# EAGLE design 3PCurrentTX (EAGLE 6.2)
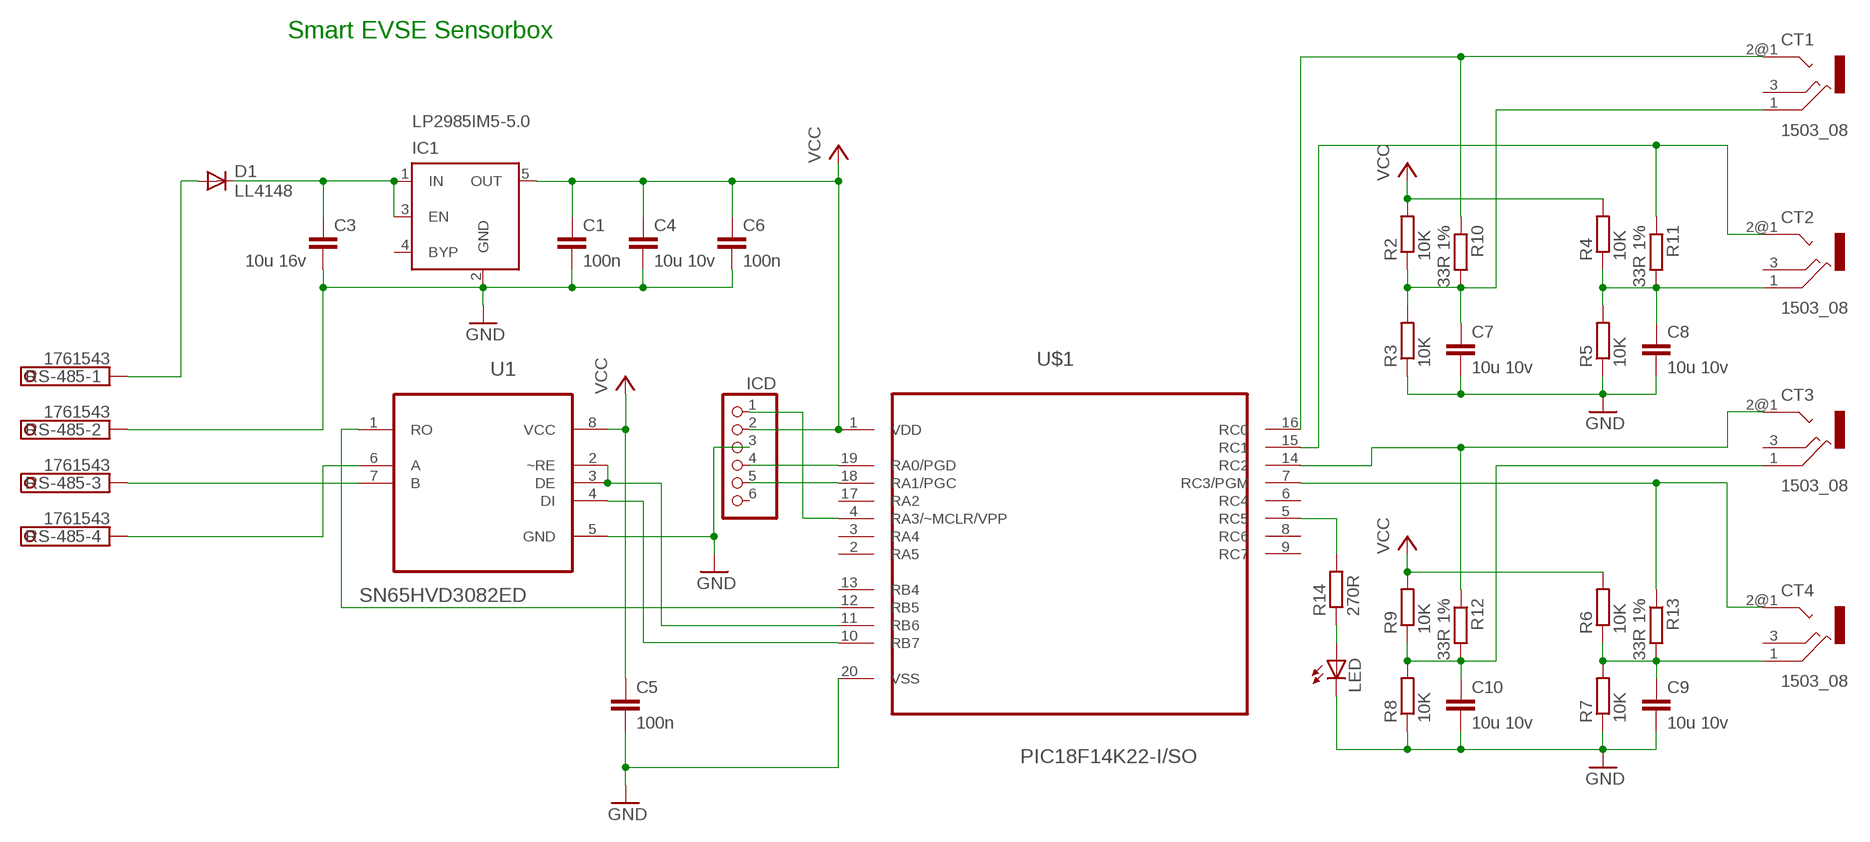
[diagram p0: schematic, sheet 1]

## Parts
C1  100n  C-EUC0805K  [C0805K]
C3  10u 16v  C-EUC1206K  [C1206K]
C4  10u 10v  C-EUC0805K  [C0805K]
C5  100n  C-EUC0805K  [C0805K]
C6  100n  C-EUC0805K  [C0805K]
C7  10u 10v  C-EUC0805K  [C0805K]
C8  10u 10v  C-EUC0805K  [C0805K]
C9  10u 10v  C-EUC0805K  [C0805K]
C10  10u 10v  C-EUC0805K  [C0805K]
CT1  1503_08  [1503_08]
CT2  1503_08  [1503_08]
CT3  1503_08  [1503_08]
CT4  1503_08  [1503_08]
D1  LL4148  DIODE-SOD123  [SOD123]
IC1  LP2985IM5-5.0  MIC5219XX  [SOT23-5]
ICD  PINHD-1X6  [1X06]
LED  LEDSML0805  [SML0805]
R2  10K  R-EU_R0805  [R0805]
R3  10K  R-EU_R0805  [R0805]
R4  10K  R-EU_R0805  [R0805]
R5  10K  R-EU_R0805  [R0805]
R6  10K  R-EU_R0805  [R0805]
R7  10K  R-EU_R0805  [R0805]
R8  10K  R-EU_R0805  [R0805]
R9  10K  R-EU_R0805  [R0805]
R10  33R 1%  R-EU_R0805  [R0805]
R11  33R 1%  R-EU_R0805  [R0805]
R12  33R 1%  R-EU_R0805  [R0805]
R13  33R 1%  R-EU_R0805  [R0805]
R14  270R  R-EU_R0805  [R0805]
RS-485  1761543  1751264  [1751264]
U1  SN65HVD3082ED  MAX487ECSA+  [SOIC127P600X175-8N]
U$1  PIC18F14K22-I/SO  [SOIC127P1030X265-20N]

## Nets
GND: C1.2 C3.2 C4.2 C5.2 C6.2 C7.2 C8.2 C9.2 C10.2 IC1.2(GND) ICD.3 LED.C R3.1 R5.1 R7.1 R8.1 RS-485.2 U1.5(GND) U$1.20(VSS)
N$2: D1.A RS-485.1
N$3: R14.2 U$1.5(RC5)
N$4: U1.1(RO) U$1.12(RB5)
N$5: U1.4(DI) U$1.10(RB7)
N$6: U1.2(~RE) U1.3(DE) U$1.11(RB6)
N$7: CT1.2@1 R10.1 U$1.16(RC0)
N$8: LED.A R14.1
N$9: CT3.2@1 R12.1 U$1.14(RC2)
N$10: CT4.2@1 R13.1 U$1.7(RC3/PGM)
N$11: CT2.2@1 R11.1 U$1.15(RC1)
N$12: RS-485.3 U1.7(B)
N$13: RS-485.4 U1.6(A)
N$14: C7.1 CT1.1 R2.1 R3.2 R10.2
N$15: C3.1 D1.C IC1.1(IN) IC1.3(EN)
N$16: ICD.5 U$1.18(RA1/PGC)
N$18: C8.1 CT2.1 R4.1 R5.2 R11.2
N$19: ICD.1 U$1.4(RA3/~MCLR/VPP)
N$20: C10.1 CT3.1 R8.2 R9.1 R12.2
N$21: C9.1 CT4.1 R6.1 R7.2 R13.2
N$22: ICD.4 U$1.19(RA0/PGD)
VCC: C1.1 C4.1 C5.1 C6.1 IC1.5(OUT) ICD.2 R2.2 R4.2 R6.2 R9.2 U1.8(VCC) U$1.1(VDD)
Unconnected: CT1.2@2 CT1.3 CT2.2@2 CT2.3 CT3.2@2 CT3.3 CT4.2@2 CT4.3 IC1.4(BYP) ICD.6 U$1.2(RA5) U$1.3(RA4) U$1.6(RC4) U$1.8(RC6) U$1.9(RC7) U$1.13(RB4) U$1.17(RA2)

## Notes on the sheet
- Smart EVSE Sensorbox

## Library data of the parts
C1 C3-C10 = resistor:C-EU: CAPACITOR, European symbol
CT1-CT4 = con-lumberg:1503_?: Jack connectors according to JISC 6560, 3.5 mm Klinkensteckverbinder nach JISC 6560, 3,5 mm Source: http://www.lumberg.com/Produkte/PDFs/1503_08.pdf; OC_FARNELL: unknown; OC_NEWARK: unknown
D1 = diode:DIODE-: DIODE
IC1 = v-reg-micrel:MIC5219XX: VOLTAGE REGULATOR; OC_FARNELL: unknown; OC_NEWARK: unknown
ICD = pinhead:PINHD-1X6: PIN HEADER
LED = led:LED: LED OSRAM: - CHIPLED LG R971, LG N971, LY N971, LG Q971, LY Q971, LO R971, LY R971 LH N974, LH R974 LS Q976, LO Q976, LY Q976 LO Q996 - Hyper CHIPLED LW Q18S LB Q993, LB Q99A, LB R99A - SideLED LS A670, LO A670, LY A670, LG A670, LP A670 LB A673, LV A673, LT A673, LW A673 LH A674 LY A675 LS A676, LA A676, LO A676, LY A676, LW A676 LS A679, LY A679, LG A679 - Hyper Micro SIDELED® LS Y876, LA Y876, LO Y876, LY Y876 LT Y87S - SmartLED LW L88C, LW L88S LB L89C, LB L89S, LG L890 LS L89K, LO L89K, LY L89K LS L896, LA L896, LO L896, LY L896 - TOPLED LS T670, LO T670, LY T670, LG T670, LP T670 LSG T670, LSP T670, LSY T670, LOP T670, LYG T670 LG T671, LOG T671, LSG T671 LB T673, LV T673, LT T673, LW T673 LH T674 LS T676, LA T676, LO T676, LY T676, LB T676, LH T676, LSB T676, LW T676 LB T67C, LV T67C, LT T67C, LS T67K, LO T67K, LY T67K, LW E67C LS E67B, LA E67B, LO E67B, LY E67B, LB E67C, LV E67C, LT E67C LW T67C LS T679, LY T679, LG T679 LS T770, LO T770, LY T770, LG T770, LP T770 LB T773, LV T773, LT T773, LW T773 LH T774 LS E675, LA E675, LY E675, LS T675 LS T776, LA T776, LO T776, LY T776, LB T776 LHGB T686 LT T68C, LB T68C - Hyper Mini TOPLED® LB M676 - Mini TOPLED Santana® LG M470 LS M47K, LO M47K, LY M47K Source: http://www.osram.convergy.de LUXEON: - LUMILED® LXK2-PW12-R00, LXK2-PW12-S00, LXK2-PW14-U00, LXK2-PW14-V00 LXK2-PM12-R00, LXK2-PM12-S00, LXK2-PM14-U00 LXK2-PE12-Q00, LXK2-PE12-R00, LXK2-PE12-S00, LXK2-PE14-T00, LXK2-PE14-U00 LXK2-PB12-K00, LXK2-PB12-L00, LXK2-PB12-M00, LXK2-PB14-N00, LXK2-PB14-P00, LXK2-PB14-Q00 LXK2-PR12-L00, LXK2-PR12-M00, LXK2-PR14-Q00, LXK2-PR14-R00 LXK2-PD12-Q00, LXK2-PD12-R00, LXK2-PD12-S00 LXK2-PH12-R00, LXK2-PH12-S00 LXK2-PL12-P00, LXK2-PL12-Q00, LXK2-PL12-R00 Source: www.luxeon.com KINGBRIGHT: KA-3528ASYC Source: www.kingbright.com
R2-R14 = rcl:R-EU_: RESISTOR, European symbol
RS-485 = con-phoenix-350:1751264: MKDS 1/ 4-3,5 Printklemme Nennstrom: 10 A Bemessungsspannung: 160 V Raster: 3,5 mm Polzahl: 4 Montageart: Löten Anschlussart: Schraubanschluss Anschlussrichtung vom Leiter zur Platine: 0° Source: http://eshop.phoenixcontact.com .. 1751264.pdf; MPN: 1751264; OC_FARNELL: unknown; OC_NEWARK: 10R0934
U1 = max487:MAX487ECSA+: Low-Power, Slew-Rate-Limited RS-485/RS-422 Transceivers; MPN: MAX487ECSA+; OC_FARNELL: 9724532; OC_NEWARK: 68K4803; PACKAGE: SOIC-8; SUPPLIER: Maxim
U$1 = pic_18f14k22:PIC18F14K22-I/SO: Flash Microcontrollers; MPN: PIC18F14k22-I/SO; OC_FARNELL: 1778463; OC_NEWARK: 07P9676; PACKAGE: SOIC-20; SUPPLIER: Microchip

## Board
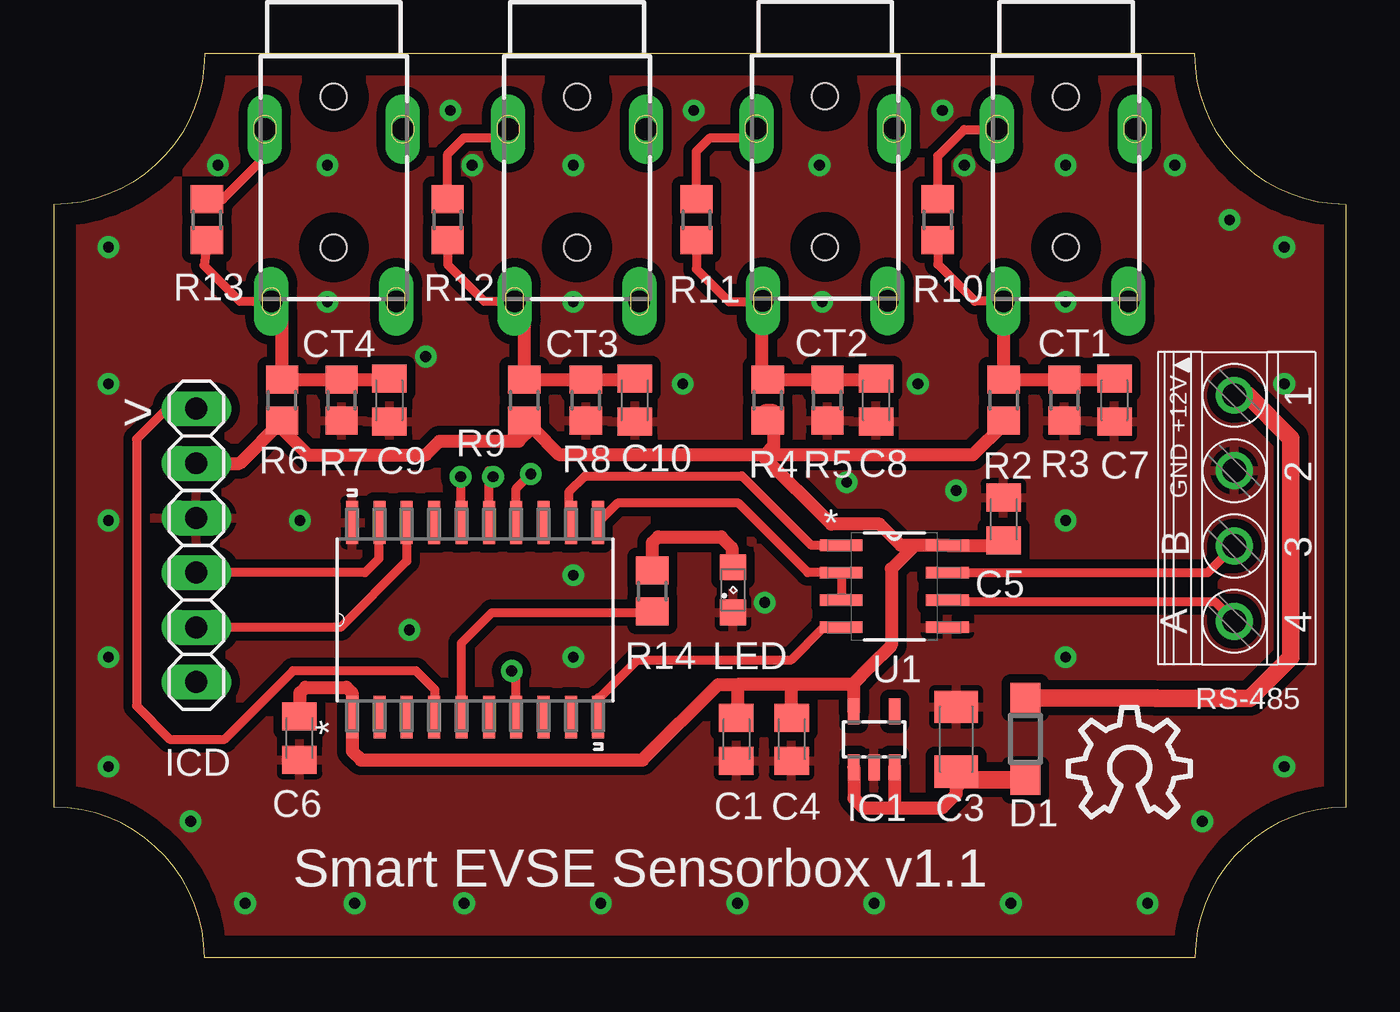
[diagram p1: board, top side]
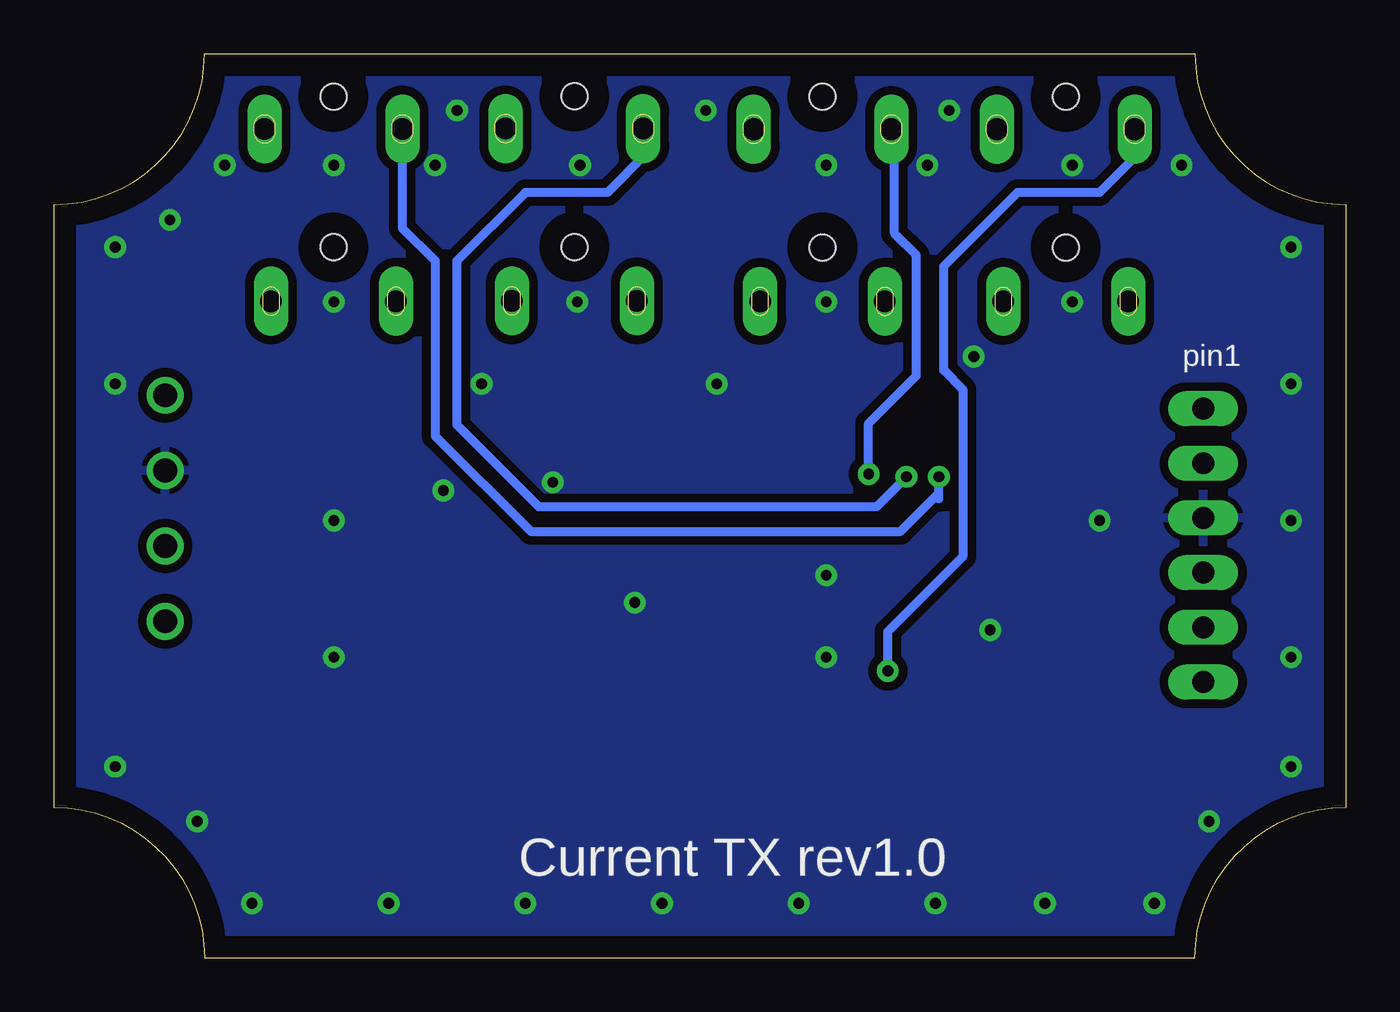
[diagram p2: board, bottom side, seen from below]

Size 60 x 42 mm. Coordinates in mm from the lower left corner, seen from the top.
Outline: 60,7.54 60,35 arc-90 53,42 7,42 arc-90 0,35 0,7 arc-90 7,0 53,0 arc-90 60,7 60,7.5
Copper layers (1*16): Top 0.035mm / dielectric 1.5mm / Bottom 0.035mm
Design rules: minimum track width 10mil, minimum drill 0.5mm, track to track 8mil, track to pad 8mil, pad to pad 8mil, via to via 8mil, smd to smd 8mil, copper to edge 40mil, drill to drill 8mil, minimum pad ring 12mil, minimum via ring 10mil, stop-mask expansion 4mil, vias tented up to drill 20mil, thermal gap 10mil

### Footprints (pad centres in the part's own frame; a part is rotated, then mirrored left to right if it is on the bottom)
C0805K = smd 1.3 x 1.6: 1 -1,0; 2 1,0
C1206K = smd 1.5 x 2: 1 -1.5,0; 2 1.5,0
1503_08 = drill 1 pad 1.2 long: 1 -2.9,-8; 2@1 -3.2,0; 2@2 3.2,0; 3 2.9,-8 | hole 1.2: 0,1.5; 0,-5.5
SOD123 = smd 1.4 x 1.4: A 1.9,0; C -1.9,0
SOT23-5 = smd 0.55 x 1.2: 1 -0.95,-1.3; 2 0,-1.3; 3 0.95,-1.3; 4 0.95,1.3; 5 -0.95,1.3
1X06 = drill 1.016 long: 1 -6.35,0; 2 -3.81,0; 3 -1.27,0; 4 1.27,0; 5 3.81,0; 6 6.35,0
SML0805 = smd 1.2 x 1.2: A 1.05,0; C -1.05,0
R0805 = smd 1.3 x 1.5: 1 -0.95,0; 2 0.95,0
1751264 = drill 1.1 pad 1.7: 1 -5.25,-0.1; 2 -1.75,-0.1; 3 1.75,-0.1; 4 5.25,-0.1
SOIC127P600X175-8N = smd 1.981 x 0.533: 1 -2.464,1.905; 2 -2.464,0.635; 3 -2.464,-0.635; 4 -2.464,-1.905; 5 2.464,-1.905; 6 2.464,-0.635; 7 2.464,0.635; 8 2.464,1.905
SOIC127P1030X265-20N = smd 1.981 x 0.559: 1 -4.521,5.715; 2 -4.521,4.445; 3 -4.521,3.175; 4 -4.521,1.905; 5 -4.521,0.635; 6 -4.521,-0.635; 7 -4.521,-1.905; 8 -4.521,-3.175; 9 -4.521,-4.445; 10 -4.521,-5.715; 11 4.521,-5.715; 12 4.521,-4.445; 13 4.521,-3.175; 14 4.521,-1.905; 15 4.521,-0.635; 16 4.521,0.635; 17 4.521,1.905; 18 4.521,3.175; 19 4.521,4.445; 20 4.521,5.715

### Placement (x,y rotation side)
C1  31.7,10.16 270 top
C3  41.91,10.16 90 top
C4  34.27,10.16 270 top
C5  44.11,20.38 90 top
C6  11.41,10.21 270 top
C7  49.26,25.91 270 top
C8  38.19,25.91 270 top
C9  15.59,25.91 270 top
C10  26.98,25.91 270 top
CT1  47.01,38.51 0 top
CT2  35.83,38.53 0 top
CT3  24.3,38.5 0 top
CT4  13,38.5 0 top
D1  45.12,10.18 90 top
IC1  38.1,10.16 0 top
ICD  6.62,19.17 270 top
LED  31.54,17.11 90 top
R2  44.12,25.91 270 top
R3  46.94,25.91 90 top
R4  33.16,25.91 270 top
R5  35.93,25.91 90 top
R6  10.6,25.91 270 top
R7  13.37,25.91 90 top
R8  24.71,25.91 90 top
R9  21.86,25.91 270 top
R10  41.06,34.29 270 top
R11  29.85,34.29 270 top
R12  18.29,34.29 270 top
R13  7.11,34.29 270 top
R14  27.8,17.04 270 top
RS-485  54.93,20.89 270 top
U1  39.04,17.26 0 top
U$1  19.57,15.71 90 top
U$2  [OSHW_10X200_NOTEXT]  47.12,6.57 0 top

### Tracks (layer width: path | path; a pad name or v marks a point on that pad's centre or on a via)
GND  (via drill 0.5)
  other vias: 13.97,2.54 24.13,13.97 24.13,17.78 16.51,15.24 12.7,30.48 29.21,26.67 40.13,26.67 2.54,33.02 2.54,26.67 2.54,20.32 2.54,13.97 2.54,8.89 6.35,6.35 8.89,2.54 7.62,36.83 12.7,36.83 18.41,39.37 24.13,36.83 29.72,39.37 35.56,36.83 41.27,39.37 46.99,36.83 52.07,36.83 54.61,34.29 57.15,33.02 57.15,26.67 57.15,8.89 53.34,6.35 50.8,2.54 44.45,2.54 38.1,2.54 31.75,2.54 25.4,2.54 19.05,2.54 33.02,16.51 46.99,20.32 46.99,13.97 17.27,27.94 36.83,22.1 41.91,21.72 35.69,30.48 46.99,30.48 24.13,30.48 19.43,36.83 42.29,36.83 11.43,20.32
  pour Top (isolate 0.406): 0,41.91 59.69,41.91 59.69,0 0,0
  pour Bottom (isolate 0.406): 0,41.91 59.69,41.91 59.69,0 0,0
N$2
  Top 0.406: 55.45,26.14 RS-485.1
  Top 0.813: 55.45,26.14 57.46,24.13 57.46,13.97 55.55,12.06 51.2,12.06 51.2,12.08 D1.A
N$3
  Top 0.406: U$1.5 18.93,14.62 20.36,16.05 27.76,16.05 R14.2
N$4
  Top 0.406: U$1.12 23.92,20.33 23.92,21.64 24.68,22.4 31.96,22.4 35.19,19.17 U1.1
N$5
  Top 0.254: 25.12,11.35 U$1.10
  Top 0.406: 25.19,11.29 U$1.10 25.29,12.09 25.34,12.09 27.1,13.85 34.25,13.85 35.7,15.3 36.52,15.3 U1.4
N$6
  Top 0.406: U1.3 U1.2 35.02,17.9 31.79,21.13 26.18,21.13 U$1.11
N$7  (via drill 0.5)
  Top 0.406: v18.89,22.35 18.89,20.27 U$1.16 | R10.1 41.06,37.25 42.29,38.48 43.78,38.48 CT1.2@1
  Bottom 0.406: CT1.2@1 43.81,33.91 42.29,32.38 42.29,24.26 37.85,19.81 20.67,19.81 18.89,21.59 | 18.89,21.34 18.89,21.59 | 18.89,21.59 v18.89,22.35
  Bottom 0.61: v18.89,22.35
N$8
  Top 0.61: R14.1 27.8,19.29 28.07,19.56 30.99,19.56 31.5,19.05 31.5,18.2 LED.A
N$9  (via drill 0.5)
  Top 0.406: U$1.14 21.48,21.8 v22.15,22.48 | R12.1 18.29,37.34 19.05,38.1 20.7,38.1 CT3.2@1
  Bottom 0.406: 21.1,37.32 CT3.2@1 20.95,38.35 20.95,33.66 19.94,32.64 19.94,27.05 22.15,24.84 v22.15,22.48
  Bottom 0.61: 20.89,38.29 CT3.2@1
N$10  (via drill 0.5)
  Top 0.406: U$1.7 21.48,13.12 v21.27,13.34 | 9.78,38.48 CT4.2@1 9.8,37.19 7.85,35.24 R13.1
  Bottom 0.406: v21.27,13.34 21.27,15.16 17.78,18.64 17.78,26.42 18.67,27.3 18.67,32.13 15.24,35.56 11.43,35.56 9.8,37.19 CT4.2@1
N$11  (via drill 0.5)
  Top 0.406: U$1.15 20.2,22.63 v20.41,22.35 | R11.1 29.85,37.47 30.48,38.1 32.2,38.1 CT2.2@1
  Bottom 0.406: v20.41,22.35 21.8,20.95 37.47,20.95 41.27,24.77 41.27,32.38 38.1,35.56 34.29,35.56 32.51,37.34 32.51,38.41 CT2.2@1
N$12
  Top 0.406: U1.7 53.59,17.9 RS-485.3
N$13
  Top 0.305: 41.43,16.56 U1.6
  Top 0.406: 41.43,16.56 53.91,16.56 RS-485.4
N$14
  Top 0.406: 44.16,30.46 CT1.1 42.77,30.51 41.06,32.23 R10.2
  Top 0.61: C7.1 49.21,26.86 R3.2 R2.1 CT1.1
N$15
  Top 0.61: IC1.1 37.15,7.43 37.59,6.99 39.12,6.99 | 39.12,6.99 41.27,6.99 41.91,7.62 41.91,7.9 42.29,8.28 | IC1.3 39.05,7.05 39.12,6.99
  Top 0.813: D1.C 42.29,8.28 C3.1
N$16
  Top 0.406: U$1.18 16.39,18.43 13.32,15.36 ICD.5
N$18
  Top 0.406: 32.88,30.48 31.37,30.48 29.85,32 R11.2
  Top 0.61: C8.1 38.14,26.86 R5.2 R4.1 32.88,27.14 32.88,30.48 CT2.1
N$19
  Top 0.406: U$1.4 17.7,11.22 17.7,12.46 16.82,13.34 11.11,13.34 7.93,10.16 5.39,10.16 3.84,11.71 3.84,24.1 5.26,25.52 ICD.1
N$20
  Top 0.406: CT3.1 20.01,30.5 18.29,32.22 R12.2
  Top 0.61: C10.1 26.93,26.86 R8.2 R9.1 21.86,30.05 CT3.1
N$21
  Top 0.406: CT4.1 8.65,30.5 6.98,32.17 R13.2
  Top 0.61: C9.1 15.54,26.86 R7.2 R6.1 10.6,30 CT4.1
N$22
  Top 0.406: U$1.19 15.1,20.21 15.1,18.55 14.45,17.9 ICD.4
VCC
  Top 0.61: 33.42,25.42 R4.2 | U1.8 39.34,19.17 38.35,20.15 36.11,20.15 32.89,23.37 | U1.8 39.99,19.17 38.9,18.08 38.9,14.53 37.89,13.51 37.89,13.5 37.15,12.77 | IC1.5 37.15,12.77 | 31.69,11.18 C1.1 31.75,11.21 31.75,12.57 31.69,12.64 | 37.15,12.77 37.08,12.7 34.29,12.7 | C6.1 11.43,11.19 11.43,12.32 11.68,12.57 13.59,12.57 13.84,12.32 13.84,11.2 U$1.1 13.86,9.6 14.26,9.19 27.35,9.19 30.86,12.7 31.62,12.7 31.69,12.64 | 34.29,12.7 31.75,12.7 31.69,12.64 | C4.1 34.27,12.68 34.29,12.7 | 33.42,25.42 33.02,25.42 | R2.2 44.12,24.81 42.67,23.37 33.02,23.37 | 33.02,23.37 32.89,23.37 | 32.89,23.37 23.5,23.37 22.23,24.64 | 33.42,25.42 33.42,23.77 33.02,23.37 | ICD.2 8.62,22.98 R6.2 10.6,24.58 11.81,23.37 17.27,23.37 17.91,24 21.59,24 22.23,24.64 | 21.66,24.77 R9.2 21.91,24.96 22.23,24.64 | U1.8 43.9,19.17 C5.1

### Text on the board
tNames: > | +12V | GND | B | A | Smart EVSE Sensorbox v1.1
bNames: pin1 | Current TX rev1.0
_tNames: R13 | R12 | R11 | R10 | CT4 | CT3 | CT2 | CT1 | R6 | R9 | R8 | C10 | R7 | C9 | R4 | R5 | C8 | R2 | R3 | C7 | C5 | R14 | LED | U1 | RS-485 | ICD | C6 | C1 | C4 | IC1 | C3 | D1
_tValues: PIC18F14K22-I/SO | 33R 1% | 33R 1% | 33R 1% | 33R 1% | 10u 10v | 1503_08 | 1503_08 | 10u 10v | 1503_08 | 10u 10v | 1503_08 | 10K | 10K | 10K | 10K | 100n | 10u 10v | 10K | 10K | 270R | 1761543 | 10K | 10K | 3mm | PIC18F14K22-I/SO | SN65HVD3082ED | 100n | 100n | 10u 16v | 1N4148 | 10u 10v
200bmp: D:/projects/stegen.com/SE_logo.bmp